# Altium schematic sheet POTENCIA.SchDoc
size A4
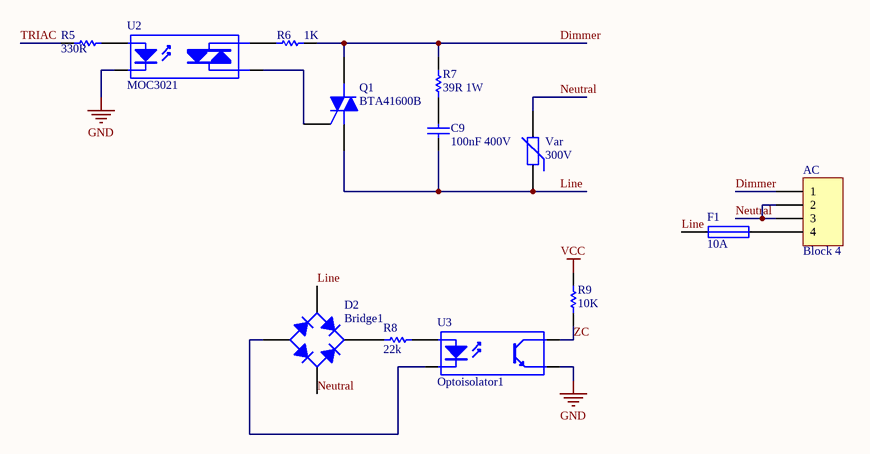
[diagram p0: POTENCIA.SchDoc]

## Parts
AC  Block 4  [BOR-4-7.5]
C9  100nF 400V  [RAD-0.4]
D2  Bridge1  [DF1502S-T]
F1  10A  [FUSE HOLDER]
Q1  BTA41600B  [TOP3 SINKED]
R5  330R  [CR3216-1206]
R6  1k  [CR3216-1206]
R7  39R 1W  [AXIAL- 1W]
R8  22k  [AXIAL-0.4]
R9  10K  [6-0805_N]
U2  MOC3021  [DIP-6]
U3  Optoisolator1  [DIP-4]
Var  300V  [S20K115]

## Nets
GND: U2.2(K) U3.3(E)
VCC: R9.2
Dimmer: AC.1 Q1.2(M2) R6.2 R7.2
Line: C9.1 D2.4(C) F1.1 Q1.1(M1) Var.1
Neutral: AC.2 AC.3 D2.2(C) Var.2
TRIAC: R5.1
ZC: R9.1 U3.4(C)
NetAC_4: AC.4 F1.2
NetC9_2: C9.2 R7.1
NetD2_1: D2.1(K) R8.2
NetD2_3: D2.3(A) U3.2(K)
NetQ1_3: Q1.3(G) U2.4(A/K)
NetR5_2: R5.2 U2.1(A)
NetR6_1: R6.1 U2.6(A/K)
NetR8_1: R8.1 U3.1(A)

## Library data of the parts
AC = Header 4: Header, 4-Pin; LatestRevisionDate: 17-Jul-2002; LatestRevisionNote: Re-released for DXP Platform.; Publisher: Altium Limited
C9 = Cap: Capacitor; Published: 8-Jun-2000; LatestRevisionDate: 17-Jul-2002; LatestRevisionNote: Re-released for DXP Platform.; PackageReference: RAD-0.3; Publisher: Altium Limited; PackageDescription: Radial Cap, Thru-Hole; 2 Leads; 0.3 in Pin Spacing; Value: 100nF 400V
D2 = Bridge1: Full Wave Diode Bridge; Published: 8-Jun-2000; LatestRevisionDate: 29-May-2009; LatestRevisionNote: Sch pins A & K swapped.; DatasheetVersion: E2732B; PackageReference: D-38; Publisher: Altium Limited; PackageDescription: Bridge Rectifier; 4 Terminals; Body 9.4 x 9.4 mm (typ); Pitch 5.08 mm
F1 = Fuse 1: Fuse; Published: 8-Jun-2000; LatestRevisionDate: 17-Jul-2002; LatestRevisionNote: Re-released for DXP Platform.; PackageReference: PIN-W2/E2.8; Publisher: Altium Limited; PackageDescription: Thru-Hole; 2 Leads
Q1 = Triac: Silicon Bidirectional Triode Thyristor; PackageReference: 369-03
R5-R9 = Res1: Resistor; PackageReference: AXIAL-0.3
  R5: Value: 330R
  R6: Value: 1K
  R7: Value: 39R 1W
  R8: Value: 22k
  R9: Value: 10K
U3 = Optoisolator1: 4-Pin Phototransistor Optocoupler; Published: 24-Mar-1999; LatestRevisionDate: 04-Mar-2005; LatestRevisionNote: Sch pins 3 & 4 Swapped.; DatasheetVersion: Nov-2003; PackageReference: DIP-4; Publisher: Altium Limited
Var = Res Varistor: Varistor (Voltage-Sensitive Resistor); Published: 24-Mar-1999; LatestRevisionDate: 29-May-2009; LatestRevisionNote: IPC-7351 Footprint Added.; PackageVersion: Mar-2003; PackageReference: 6-0805; Publisher: Altium Limited; PackageDescription: Chip Resistor 0805 Case Size; Code_IPC: RESC2012